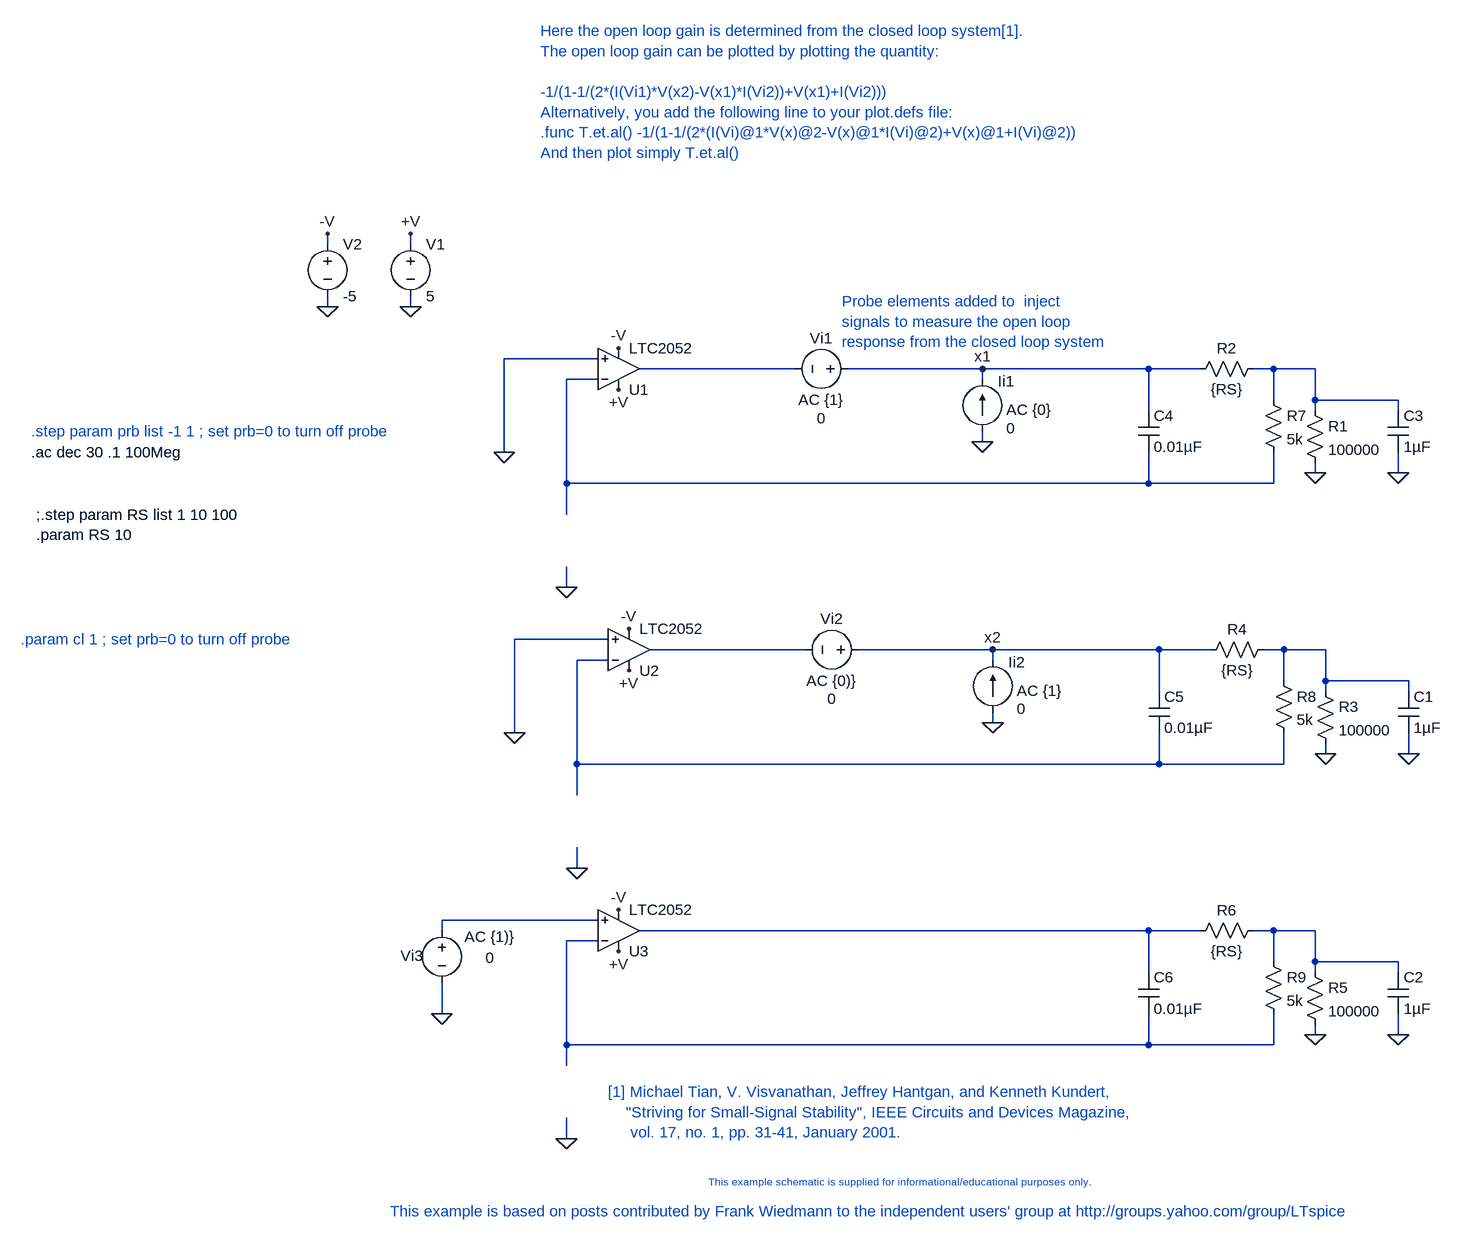
[diagram p0: schematic behavioral linear opamp stability 04.asc]
behavioral linear opamp stability 04.asc, the LTspice schematic file:
Version 4
SHEET 1 1764 1376
WIRE -2160 -128 -2160 -144
WIRE -2032 -128 -2032 -144
WIRE -2160 -32 -2160 -48
WIRE -2032 -32 -2032 -48
WIRE -1744 48 -1888 48
WIRE -1440 64 -1680 64
WIRE -1152 64 -1360 64
WIRE -896 64 -1152 64
WIRE -816 64 -896 64
WIRE -704 64 -736 64
WIRE -640 64 -704 64
WIRE -1744 80 -1792 80
WIRE -1152 80 -1152 64
WIRE -704 112 -704 64
WIRE -640 112 -640 64
WIRE -512 112 -640 112
WIRE -896 128 -896 64
WIRE -640 128 -640 112
WIRE -512 128 -512 112
WIRE -1152 176 -1152 160
WIRE -1888 192 -1888 48
WIRE -640 224 -640 208
WIRE -512 224 -512 192
WIRE -1792 240 -1792 80
WIRE -896 240 -896 192
WIRE -896 240 -1792 240
WIRE -704 240 -704 192
WIRE -704 240 -896 240
WIRE -1792 288 -1792 240
WIRE -1792 400 -1792 368
WIRE -1728 480 -1872 480
WIRE -1424 496 -1664 496
WIRE -1136 496 -1344 496
WIRE -880 496 -1136 496
WIRE -800 496 -880 496
WIRE -688 496 -720 496
WIRE -624 496 -688 496
WIRE -1728 512 -1776 512
WIRE -1136 512 -1136 496
WIRE -688 544 -688 496
WIRE -624 544 -624 496
WIRE -496 544 -624 544
WIRE -880 560 -880 496
WIRE -624 560 -624 544
WIRE -496 560 -496 544
WIRE -1136 608 -1136 592
WIRE -1872 624 -1872 480
WIRE -624 656 -624 640
WIRE -496 656 -496 624
WIRE -1776 672 -1776 512
WIRE -880 672 -880 624
WIRE -880 672 -1776 672
WIRE -688 672 -688 624
WIRE -688 672 -880 672
WIRE -1776 720 -1776 672
WIRE -1776 832 -1776 800
WIRE -1744 912 -1984 912
WIRE -1984 928 -1984 912
WIRE -896 928 -1680 928
WIRE -816 928 -896 928
WIRE -704 928 -736 928
WIRE -640 928 -704 928
WIRE -1744 944 -1792 944
WIRE -704 976 -704 928
WIRE -640 976 -640 928
WIRE -512 976 -640 976
WIRE -896 992 -896 928
WIRE -640 992 -640 976
WIRE -512 992 -512 976
WIRE -1984 1056 -1984 1008
WIRE -640 1088 -640 1072
WIRE -512 1088 -512 1056
WIRE -1792 1104 -1792 944
WIRE -896 1104 -896 1056
WIRE -896 1104 -1792 1104
WIRE -704 1104 -704 1056
WIRE -704 1104 -896 1104
WIRE -1792 1136 -1792 1104
WIRE -1792 1248 -1792 1216
FLAG -1888 192 0
FLAG -640 224 0
FLAG -1152 176 0
FLAG -1152 64 x1
FLAG -512 224 0
FLAG -1872 624 0
FLAG -624 656 0
FLAG -1136 608 0
FLAG -1136 496 x2
FLAG -496 656 0
FLAG -1984 1056 0
FLAG -640 1088 0
FLAG -512 1088 0
FLAG -2032 -32 0
FLAG -2032 -144 +V
FLAG -2160 -32 0
FLAG -2160 -144 -V
FLAG -1712 32 -V
FLAG -1712 96 +V
FLAG -1696 464 -V
FLAG -1696 528 +V
FLAG -1712 896 -V
FLAG -1712 960 +V
FLAG -1792 1248 0
FLAG -1776 832 0
FLAG -1792 400 0
SYMBOL res -656 112 R0
SYMATTR InstName R1
SYMATTR Value 100000
SYMBOL current -1152 160 M180
WINDOW 0 24 77 Left 2
WINDOW 3 37 5 Left 2
WINDOW 123 37 33 Left 2
WINDOW 39 0 0 Left 2
SYMATTR InstName Ii1
SYMATTR Value 0
SYMATTR Value2 AC {0}
SYMBOL voltage -1344 64 M270
WINDOW 0 32 56 VTop 2
WINDOW 3 -60 56 VBottom 2
WINDOW 123 -32 56 VBottom 2
WINDOW 39 -32 56 VBottom 2
SYMATTR InstName Vi1
SYMATTR Value 0
SYMATTR Value2 AC {1}
SYMBOL cap -528 128 R0
SYMATTR InstName C3
SYMATTR Value 1µF
SYMBOL res -720 48 R90
WINDOW 0 0 56 VBottom 2
WINDOW 3 32 56 VTop 2
SYMATTR InstName R2
SYMATTR Value {RS}
SYMBOL res -640 544 R0
SYMATTR InstName R3
SYMATTR Value 100000
SYMBOL current -1136 592 M180
WINDOW 0 24 77 Left 2
WINDOW 3 37 5 Left 2
WINDOW 123 37 33 Left 2
WINDOW 39 0 0 Left 2
SYMATTR InstName Ii2
SYMATTR Value 0
SYMATTR Value2 AC {1}
SYMBOL voltage -1328 496 M270
WINDOW 0 32 56 VTop 2
WINDOW 3 -60 56 VBottom 2
WINDOW 123 -32 56 VBottom 2
WINDOW 39 -32 56 VBottom 2
SYMATTR InstName Vi2
SYMATTR Value 0
SYMATTR Value2 AC {0)}
SYMBOL cap -512 560 R0
SYMATTR InstName C1
SYMATTR Value 1µF
SYMBOL res -704 480 R90
WINDOW 0 0 56 VBottom 2
WINDOW 3 32 56 VTop 2
SYMATTR InstName R4
SYMATTR Value {RS}
SYMBOL res -656 976 R0
SYMATTR InstName R5
SYMATTR Value 100000
SYMBOL voltage -1984 912 M0
WINDOW 0 46 70 Bottom 2
WINDOW 3 -74 42 Top 2
WINDOW 123 -74 10 Top 2
WINDOW 39 -32 56 VBottom 2
SYMATTR InstName Vi3
SYMATTR Value 0
SYMATTR Value2 AC {1)}
SYMBOL cap -528 992 R0
SYMATTR InstName C2
SYMATTR Value 1µF
SYMBOL res -720 912 R90
WINDOW 0 0 56 VBottom 2
WINDOW 3 32 56 VTop 2
SYMATTR InstName R6
SYMATTR Value {RS}
SYMBOL Opamps\\LTC2052 -1712 64 M180
SYMATTR InstName U1
SYMBOL voltage -2032 -144 R0
SYMATTR InstName V1
SYMATTR Value 5
SYMBOL voltage -2160 -144 R0
SYMATTR InstName V2
SYMATTR Value -5
SYMBOL Opamps\\LTC2052 -1696 496 M180
SYMATTR InstName U2
SYMBOL Opamps\\LTC2052 -1712 928 M180
SYMATTR InstName U3
SYMBOL cap -912 128 R0
SYMATTR InstName C4
SYMATTR Value 0.01µF
SYMBOL cap -896 560 R0
SYMATTR InstName C5
SYMATTR Value 0.01µF
SYMBOL cap -912 992 R0
SYMATTR InstName C6
SYMATTR Value 0.01µF
SYMBOL res -720 96 R0
SYMATTR InstName R7
SYMATTR Value 5k
SYMBOL res -704 528 R0
SYMATTR InstName R8
SYMATTR Value 5k
SYMBOL res -720 960 R0
SYMATTR InstName R9
SYMATTR Value 5k
TEXT -2616 192 Left 2 !.ac dec 30 .1 100Meg
TEXT -1832 -456 Left 2 ;Here the open loop gain is determined from the closed loop system[1].\nThe open loop gain can be plotted by plotting the quantity:\n \n-1/(1-1/(2*(I(Vi1)*V(x2)-V(x1)*I(Vi2))+V(x1)+I(Vi2)))\nAlternatively, you add the following line to your plot.defs file:\n.func T.et.al() -1/(1-1/(2*(I(Vi)@1*V(x)@2-V(x)@1*I(Vi)@2)+V(x)@1+I(Vi)@2))\nAnd then plot simply T.et.al()
TEXT -1288 1304 Top 1 ;This example schematic is supplied for informational/educational purposes only.
TEXT -1728 1176 Left 2 ;[1] Michael Tian, V. Visvanathan, Jeffrey Hantgan, and Kenneth Kundert,\n    "Striving for Small-Signal Stability", IEEE Circuits and Devices Magazine,\n     vol. 17, no. 1, pp. 31-41, January 2001.
TEXT -2616 160 Left 2 ;.step param prb list -1 1 ; set prb=0 to turn off probe
TEXT -1368 -40 Left 2 ;Probe elements added to  inject\nsignals to measure the open loop\nresponse from the closed loop system
TEXT -2064 1360 Left 2 ;This example is based on posts contributed by Frank Wiedmann to the independent users' group at http://groups.yahoo.com/group/LTspice
TEXT -2608 288 Left 2 !;.step param RS list 1 10 100\n.param RS 10
TEXT -2632 480 Left 2 ;.param cl 1 ; set prb=0 to turn off probe

The netlist it stands for:
* behavioral linear opamp stability 04.asc
R1 N002 0 100000
Ii1 0 x1 0 AC {0}
Vi1 x1 N001 0 AC {1}
C3 N002 0 1µF
R2 N002 x1 {RS}
R3 N005 0 100000
Ii2 0 x2 0 AC {1}
Vi2 x2 N004 0 AC {0)}
C1 N005 0 1µF
R4 N005 x2 {RS}
R5 N009 0 100000
Vi3 N007 0 0 AC {1)}
C2 N009 0 1µF
R6 N009 N008 {RS}
* U1: LTC2052 (symbol Opamps\LTC2052 not available, pins judged from their places): In+=0 In-=N003 V+=+V V-=-V OUT=N001
V1 +V 0 5
V2 -V 0 -5
* U2: LTC2052 (symbol Opamps\LTC2052 not available, pins judged from their places): In+=0 In-=N006 V+=+V V-=-V OUT=N004
* U3: LTC2052 (symbol Opamps\LTC2052 not available, pins judged from their places): In+=N007 In-=N010 V+=+V V-=-V OUT=N008
C4 x1 N003 0.01µF
C5 x2 N006 0.01µF
C6 N008 N010 0.01µF
R7 N002 N003 5k
R8 N005 N006 5k
R9 N009 N010 5k
.ac dec 30 .1 100Meg
* Here the open loop gain is determined from the closed loop system[1].
* The open loop gain can be plotted by plotting the quantity:
* -1/(1-1/(2*(I(Vi1)*V(x2)-V(x1)*I(Vi2))+V(x1)+I(Vi2)))
* Alternatively, you add the following line to your plot.defs file:
* .func T.et.al() -1/(1-1/(2*(I(Vi)@1*V(x)@2-V(x)@1*I(Vi)@2)+V(x)@1+I(Vi)@2))
* And then plot simply T.et.al()
* This example schematic is supplied for informational/educational purposes only.
* [1] Michael Tian, V. Visvanathan, Jeffrey Hantgan, and Kenneth Kundert,
*     "Striving for Small-Signal Stability", IEEE Circuits and Devices Magazine,
*      vol. 17, no. 1, pp. 31-41, January 2001.
* .step param prb list -1 1 ; set prb=0 to turn off probe
* Probe elements added to  inject
* signals to measure the open loop
* response from the closed loop system
* This example is based on posts contributed by Frank Wiedmann to the independent users' group at http://groups.yahoo.com/group/LTspice
;.step param RS list 1 10 100
.param RS 10
* .param cl 1 ; set prb=0 to turn off probe
.backanno
.end